# EAGLE design uSupply_upgrade (EAGLE 6.4)
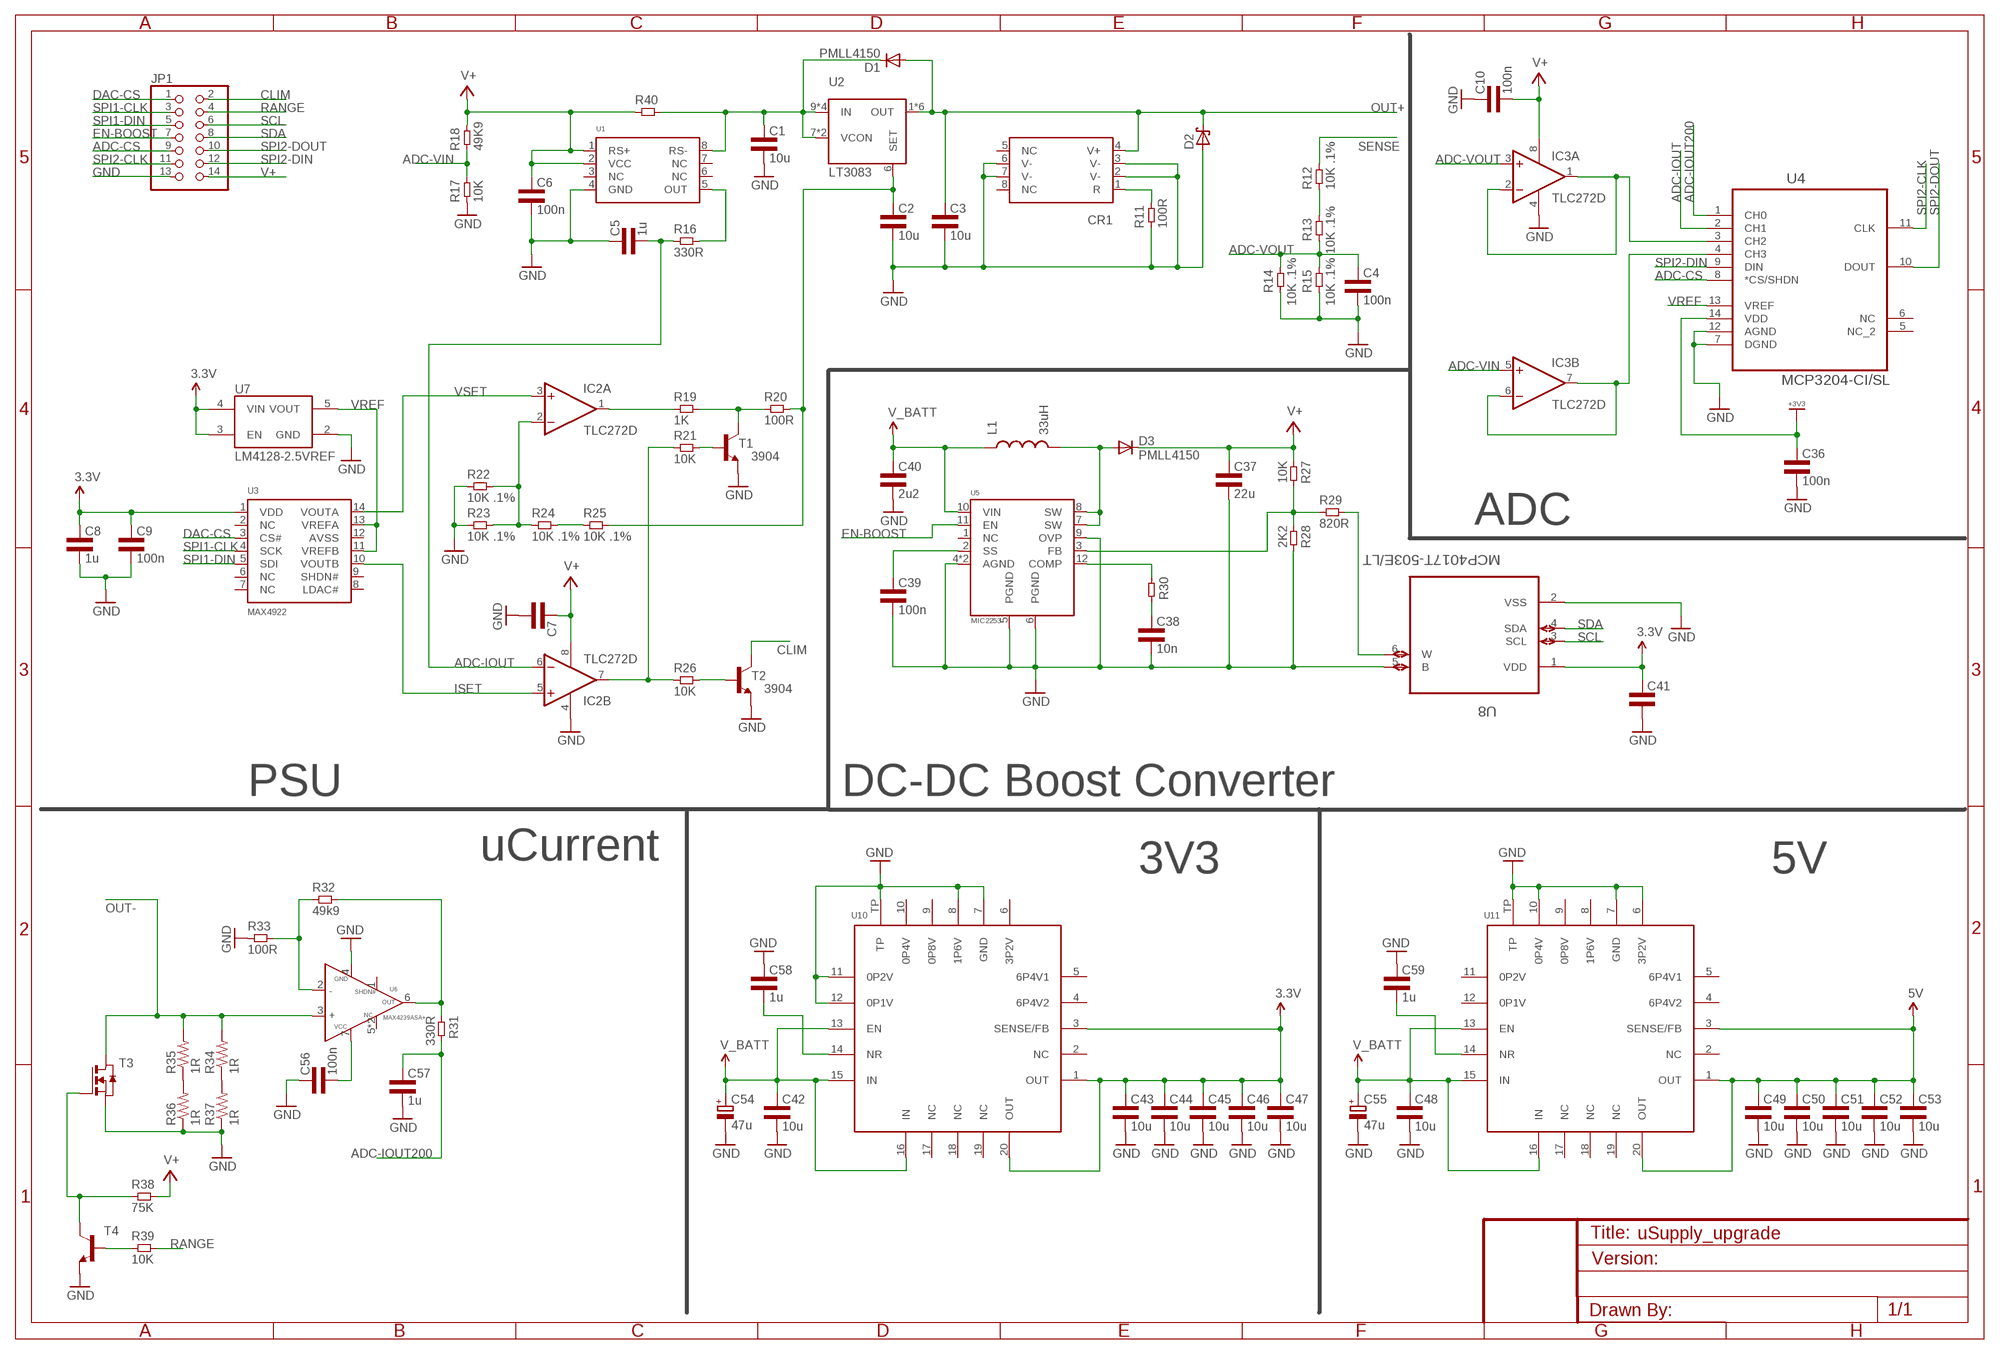
[diagram p0: schematic, sheet 1]

## Parts
C1  10u  CAP0805L3  [0805L3]
C2  10u  CAP0805L3  [0805L3]
C3  10u  CAP0805L3  [0805L3]
C4  100n  CAP0603L3  [0603L3]
C5  1u  CAP0603L3  [0603L3]
C6  100n  CAP0603L3  [0603L3]
C7  CAP0603L3  [0603L3]
C8  1u  CAP0603L3  [0603L3]
C9  100n  CAP0603L3  [0603L3]
C10  100n  CAP0603L3  [0603L3]
C36  100n  CAP0603L3  [0603L3]
C37  22u  CAP1206L3  [1206L3]
C38  10n  CAP0603L3  [0603L3]
C39  100n  CAP0603L3  [0603L3]
C40  2u2  CAP0603L3  [0603L3]
C41  CAP0603L3  [0603L3]
C42  10u  CAP0805L3  [0805L3]
C43  10u  CAP0805L3  [0805L3]
C44  10u  CAP0805L3  [0805L3]
C45  10u  CAP0805L3  [0805L3]
C46  10u  CAP0805L3  [0805L3]
C47  10u  CAP0805L3  [0805L3]
C48  10u  CAP0805L3  [0805L3]
C49  10u  CAP0805L3  [0805L3]
C50  10u  CAP0805L3  [0805L3]
C51  10u  CAP0805L3  [0805L3]
C52  10u  CAP0805L3  [0805L3]
C53  10u  CAP0805L3  [0805L3]
C54  47u  CPOL-EUCT7343  [CT7343]
C55  47u  CPOL-EUCT7343  [CT7343]
C56  100n  CAP0603L3  [0603L3]
C57  1u  CAP0603L3  [0603L3]
C58  1u  CAP0603L3  [0603L3]
C59  1u  CAP0603L3  [0603L3]
CR1  LM334  [R-PDSO-G8]
D1  PMLL4150  [SOD80C]
D2  SCHOTTKY-DIODESMD  [SMB]
D3  PMLL4150  [SOD80C]
IC2  TLC272D  [SO08]
IC3  TLC272D  [SO08]
JP1  PINHD-2X7  [2X07]
L1  33uH  INDUCTORBOURNS_SRN6045  [SRN6045]
R11  100R  RES0603L3  [0603L3]
R12  10K .1%  RES0603L3  [0603L3]
R13  10K .1%  RES0603L3  [0603L3]
R14  10K .1%  RES0603L3  [0603L3]
R15  10K .1%  RES0603L3  [0603L3]
R16  330R  RES0603L3  [0603L3]
R17  10K  RES0603L3  [0603L3]
R18  49K9  RES0603L3  [0603L3]
R19  1K  RES0603L3  [0603L3]
R20  100R  RES0603L3  [0603L3]
R21  10K  RES0603L3  [0603L3]
R22  10K .1%  RES0603L3  [0603L3]
R23  10K .1%  RES0603L3  [0603L3]
R24  10K .1%  RES0603L3  [0603L3]
R25  10K .1%  RES0603L3  [0603L3]
R26  10K  RES0603L3  [0603L3]
R27  10K  RES0603L3  [0603L3]
R28  2K2  RES0603L3  [0603L3]
R29  820R  RES0603L3  [0603L3]
R30  RES0603L3  [0603L3]
R31  330R  RES0603L3  [0603L3]
R32  49k9  RES0603L3  [0603L3]
R33  100R  RES0603L3  [0603L3]
R34  1R  R-US_R2512  [R2512]
R35  1R  R-US_R2512  [R2512]
R36  1R  R-US_R2512  [R2512]
R37  1R  R-US_R2512  [R2512]
R38  75K  RES0603L3  [0603L3]
R39  10K  RES0603L3  [0603L3]
R40  RES4527L3  [4527L3]
T1  3904  MMBT3904LT1-NPN-SOT23-BEC  [SOT23-BEC]
T2  3904  MMBT3904LT1-NPN-SOT23-BEC  [SOT23-BEC]
T3  NMOSSOT23  [SOT-23]
T4  MMBT3904LT1-NPN-SOT23-BEC  [SOT23-BEC]
U1  MAX4080  [UMAX]
U2  LT3083  [DFN4X4]
U3  MCP4922  [TSSOP-14]
U4  MCP3204-CI/SL  [SOIC127P600X175-14N]
U5  MIC2253  [MLF3X3]
U6  MAX4239  [SOIC-8]
U7  LM4128-2.5VREF  [SOT23-5]
U8  MCP4017T-503E/LT  [SOT65P210X110-6N]
U10  POWER-SUPPLY_POS_V1_TI_LDO_TPS7A4700  [POWER-SUPPLY_POS_V1_TI_LDO_VQFN-20]
U11  POWER-SUPPLY_POS_V1_TI_LDO_TPS7A4700  [POWER-SUPPLY_POS_V1_TI_LDO_VQFN-20]

## Nets
3.3V: C8.P$1 C9.P$1 C41.P$1 C43.1 C44.1 C45.1 C46.1 C47.1 U3.1(VDD) U7.3(EN) U7.4(VIN) U8.1(VDD) U10.1(OUT) U10.3(SENSE/FB) U10.20(OUT)
5V: C49.1 C50.1 C51.1 C52.1 C53.1 U11.1(OUT) U11.3(SENSE/FB) U11.20(OUT)
+3V3: C36.P$1 U4.14(VDD)
ADC-CS: JP1.9 U4.8(*CS/SHDN)
ADC-IOUT: C5.P$2 IC2.6(B:-IN) R16.P$1 U4.2(CH1)
ADC-IOUT200: C57.P$1 R31.P$2 U4.1(CH0)
ADC-VIN: IC3.5(B:+IN) R17.P$2 R18.P$1
ADC-VOUT: C4.P$1 IC3.3(A:+IN) R13.P$1 R14.P$2 R15.P$2
CLIM: JP1.2 T2.C
DAC-CS: JP1.1 U3.3(CS#)
EN-BOOST: JP1.7 U5.11(EN)
GND: C1.2 C2.2 C3.2 C4.P$2 C5.P$1 C6.P$2 C7.P$2 C8.P$2 C9.P$2 C10.P$1 C36.P$2 C37.2 C38.P$2 C39.P$2 C40.P$2 C41.P$2 C42.2 C43.2 C44.2 C45.2 C46.2 C47.2 C48.2 C49.2 C50.2 C51.2 C52.2 C53.2 C54.- C55.- C56.P$1 C57.P$2 C58.P$1 C59.P$1 CR1.2(V-) CR1.3(V-) CR1.6(V-) CR1.7(V-) D2.A IC2.4(P:V-) IC3.4(P:V-) JP1.13 R11.P$1 R14.P$1 R15.P$1 R17.P$1 R22.P$1 R23.P$1 R28.P$2 R33.P$1 R36.1 R37.1 T1.E T2.E T3.2(S) T4.E U1.4(GND) U4.7(DGND) U4.12(AGND) U5.4(AGND) U5.5(PGND) U5.6(PGND) U5.9(OVP) U5.TP(AGND) U6.4(GND) U7.2(GND) U8.2(VSS) U8.5(B) U10.7(GND) U10.8(1P6V) U10.11(0P2V) U10.12(0P1V) U10.TP U11.6(3P2V) U11.7(GND) U11.10(0P4V) U11.TP
I_R: CR1.1(R) R11.P$2
ISET: IC2.5(B:+IN) U3.10(VOUTB)
N$1: IC3.1(A:OUT) IC3.2(A:-IN) U4.3(CH2)
N$2: C56.P$2 U6.7(VCC)
N$3: D3.A L1.2 U5.7(SW) U5.8(SW)
N$4: C59.P$2 U11.14(NR)
N$5: R16.P$2 U1.5(OUT)
N$6: C58.P$2 U10.14(NR)
N$7: R31.P$1 R32.P$2 U6.6(OUT)
N$8: IC3.6(B:-IN) IC3.7(B:OUT) U4.4(CH3)
N$9: R29.P$2 U8.6(W)
N$10: R12.P$1 R13.P$2
N$11: R27.P$2 R28.P$1 R29.P$1 U5.3(FB)
N$12: R30.P$1 U5.12(COMP)
N$13: C38.P$1 R30.P$2
N$14: IC2.1(A:OUT) R19.P$1
N$15: R19.P$2 R20.P$1 T1.C
N$16: R21.P$2 T1.B
N$17: IC2.2(A:-IN) R22.P$2 R23.P$2 R24.P$1
N$18: R24.P$2 R25.P$1
N$20: R32.P$1 R33.P$2 U6.2(-)
N$22: C39.P$1 U5.2(SS)
N$23: IC2.7(B:OUT) R21.P$1 R26.P$1
N$24: R26.P$2 T2.B
N$27: R34.1 R37.2
N$28: R35.1 R36.2
N$31: R38.P$1 T3.3(G) T4.C
N$32: R39.P$1 T4.B
OUT+: C3.1 CR1.4(V+) D1.A D2.C U2.1(OUT) U2.2(OUT) U2.3(OUT) U2.4(OUT) U2.5(OUT) U2.TP(OUT)
OUT-: R34.2 R35.2 T3.1(D) U6.3(+)
RANGE: JP1.4 R39.P$2
SCL: JP1.6 U8.3(SCL)
SDA: JP1.8 U8.4(SDA)
SENSE: R12.P$2
SET: C2.1 R20.P$2 R25.P$2 U2.6(SET)
SPI1-CLK: JP1.3 U3.4(SCK)
SPI1-DIN: JP1.5 U3.5(SDI)
SPI2-CLK: JP1.11 U4.11(CLK)
SPI2-DIN: JP1.12 U4.9(DIN)
SPI2-DOUT: JP1.10 U4.10(DOUT)
V+: C6.P$1 C7.P$1 C10.P$2 C37.1 D3.C IC2.8(P:V+) IC3.8(P:V+) JP1.14 R18.P$2 R27.P$1 R38.P$2 R40.1 U1.1(RS+) U1.2(VCC)
V+_REG: C1.1 D1.C R40.2 U1.8(RS-) U2.7(VCON) U2.8(VCON) U2.9(IN) U2.10(IN) U2.11(IN) U2.12(IN)
V_BATT: C40.P$1 C42.1 C48.1 C54.+ C55.+ L1.1 U5.10(VIN) U10.13(EN) U10.15(IN) U10.16(IN) U11.13(EN) U11.15(IN) U11.16(IN)
VREF: U3.11(VREFB) U3.13(VREFA) U4.13(VREF) U7.5(VOUT)
VSET: IC2.3(A:+IN) U3.14(VOUTA)
Unconnected: CR1.5(NC) CR1.8(NC) U1.3(NC) U1.6(NC) U1.7(NC) U3.2(NC) U3.6(NC) U3.7(NC) U3.8(LDAC#) U3.9(SHDN#) U3.12(AVSS) U4.5(NC_2) U4.6(NC) U5.1(NC) U6.1(SHDN#) U6.5(NC) U6.8(NC) U10.2(NC) U10.4(6P4V2) U10.5(6P4V1) U10.6(3P2V) U10.9(0P8V) U10.10(0P4V) U10.17(NC) U10.18(NC) U10.19(NC) U11.2(NC) U11.4(6P4V2) U11.5(6P4V1) U11.8(1P6V) U11.9(0P8V) U11.11(0P2V) U11.12(0P1V) U11.17(NC) U11.18(NC) U11.19(NC)

## Notes on the sheet
- ADC
- PSU | DC-DC Boost Converter
- uCurrent | 3V3 | 5V

## Library data of the parts
C1-C10 C36-C53 C56-C59 = common:CAP
C54 C55 = rcl:CPOL-EU: POLARIZED CAPACITOR, European symbol
CR1 = common:LM334
D1 D3 = diode:PMLL4150: DIODE high speed
D2 = diode:SCHOTTKY-DIODE: Schottky Diode
IC2 IC3 = linear:TLC272: OP AMP
JP1 = pinhead:PINHD-2X7: PIN HEADER
L1 = SparkFun-Passives:INDUCTOR: Inductors Basic Inductor/Choke - 0603 and 1206. Footprints are not proven and vary greatly between part numbers. SRN6045- 33uH, 20% 1.4A; PROD_ID: NDUC-11627
R11-R33 R38-R40 = common:RES
R34-R37 = rcl:R-US_: RESISTOR, American symbol
T1 T2 T4 = transistor:*-NPN-: NPN Transistror BF959 corrected 2008.03.06
T3 = zetex:NMOSSOT23: MOS FET; OC_FARNELL: unknown; OC_NEWARK: unknown
U1 = common:MAX4080: High-side current-sense amplifier. 4.5V to 76V.
U2 = common:LT3083
U3 = common:MCP4922
U4 = Microchip_By_element14_Batch_1:MCP3204-CI/SL: IC ADC 12BIT 2.7V 4CH SPI; MPN: MCP3204-CI/SL; OC_FARNELL: 1196795; OC_NEWARK: 26M1276; PACKAGE: 14 - SOIC; SUPPLIER: Microchip
U5 = common:MIC2253: Boost Regulator
U6 = common:MAX4239: The MAX4238/MAX4239 are low-noise, low-drift, ultrahigh precision amplifiers that offer near-zero DC offset and drift through the use of patented autocorrelating zeroing techniques. This method constantly measures and compensates the input offset, eliminating drift over time and temperature and the effect of 1/f noise. Both devices feature rail-to-rail outputs, operate from a single 2.7V to 5.5V supply, and consume only 600µA. An activelow shutdown mode decreases supply current to 0.1µA.
U7 = SparkFun-PowerIC:LM4128-2.5VREF: .1% accurate low-current voltage reference
U8 = Microchip_By_element14_Batch_1:MCP4017T-503E/LT: Digital POT; MPN: MCP4017T-503E/LT; OC_FARNELL: 1825017; OC_NEWARK: 08R1800; PACKAGE: SOT-6; SUPPLIER: Microchip
U10 U11 = my_dac_amp:POWER-SUPPLY_POS_V1_TI_LDO_TPS7A4700

## Board
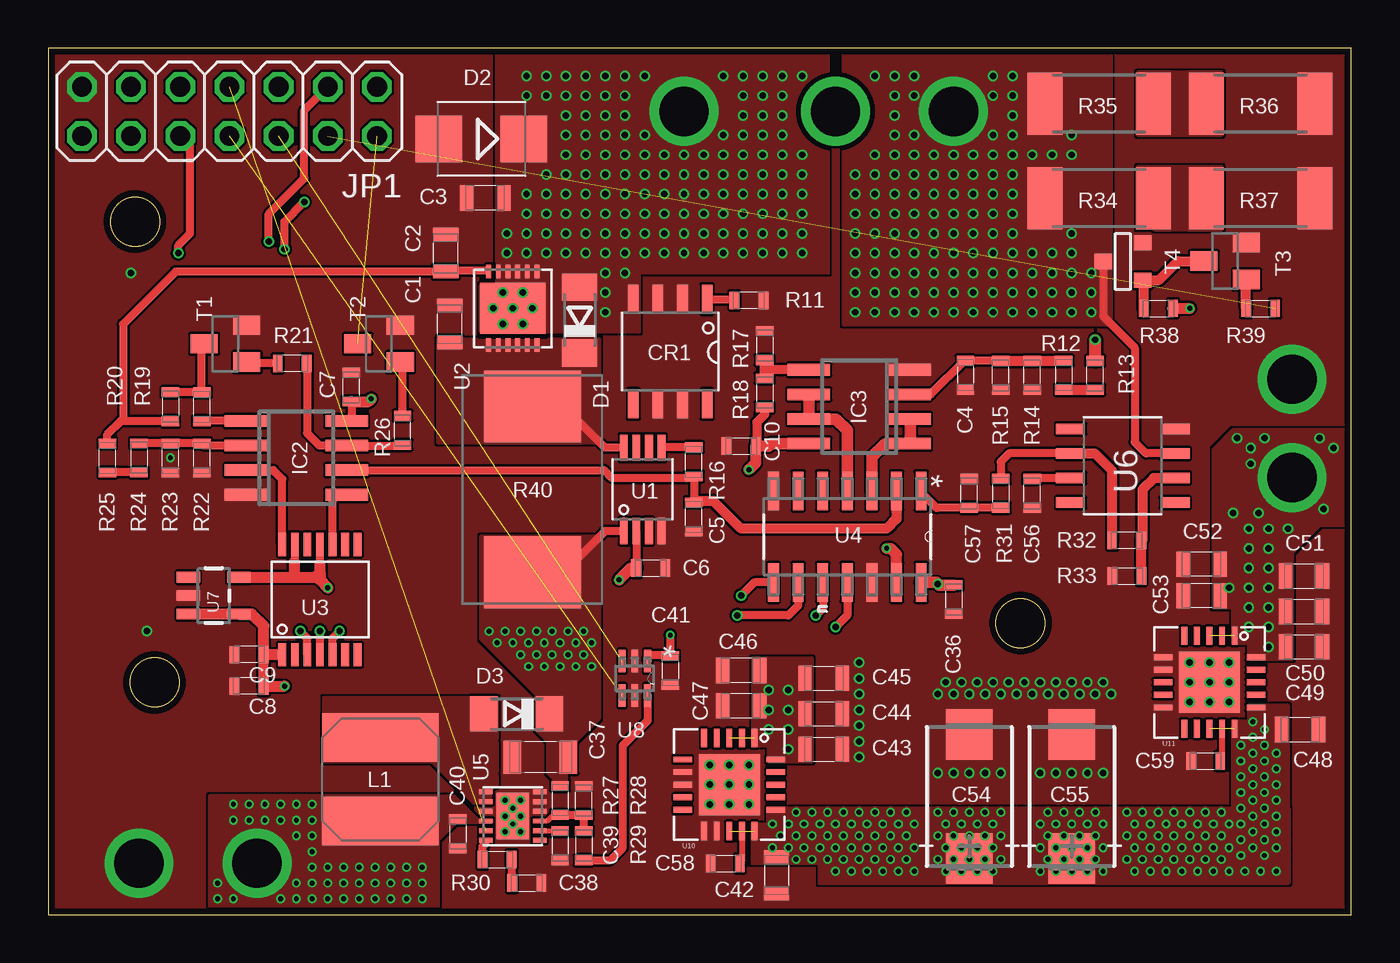
[diagram p1: board, top side]
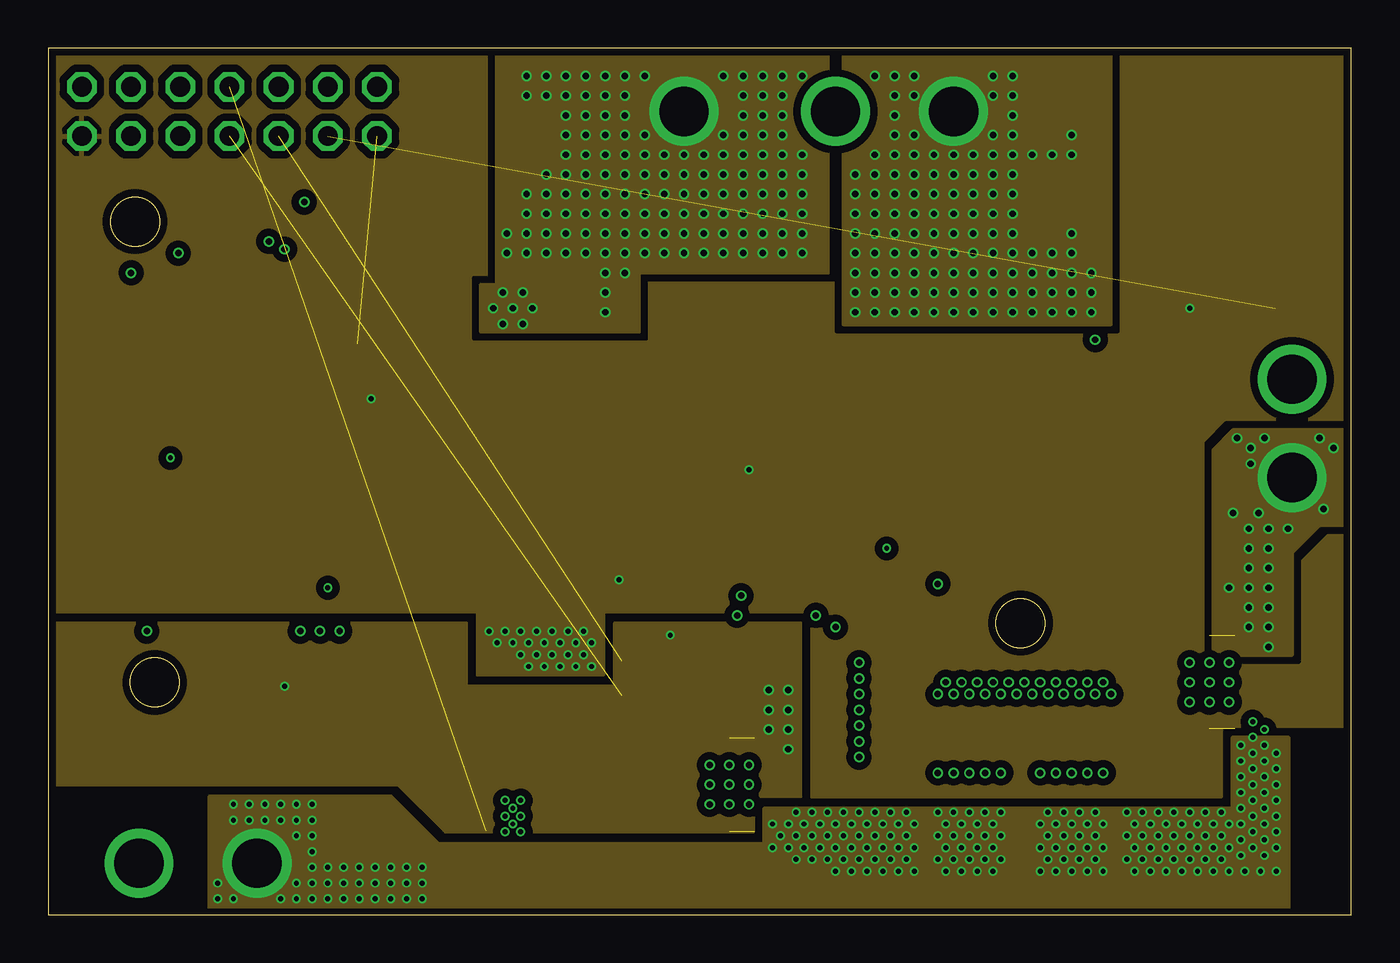
[diagram p2: board, inner layer Route2]
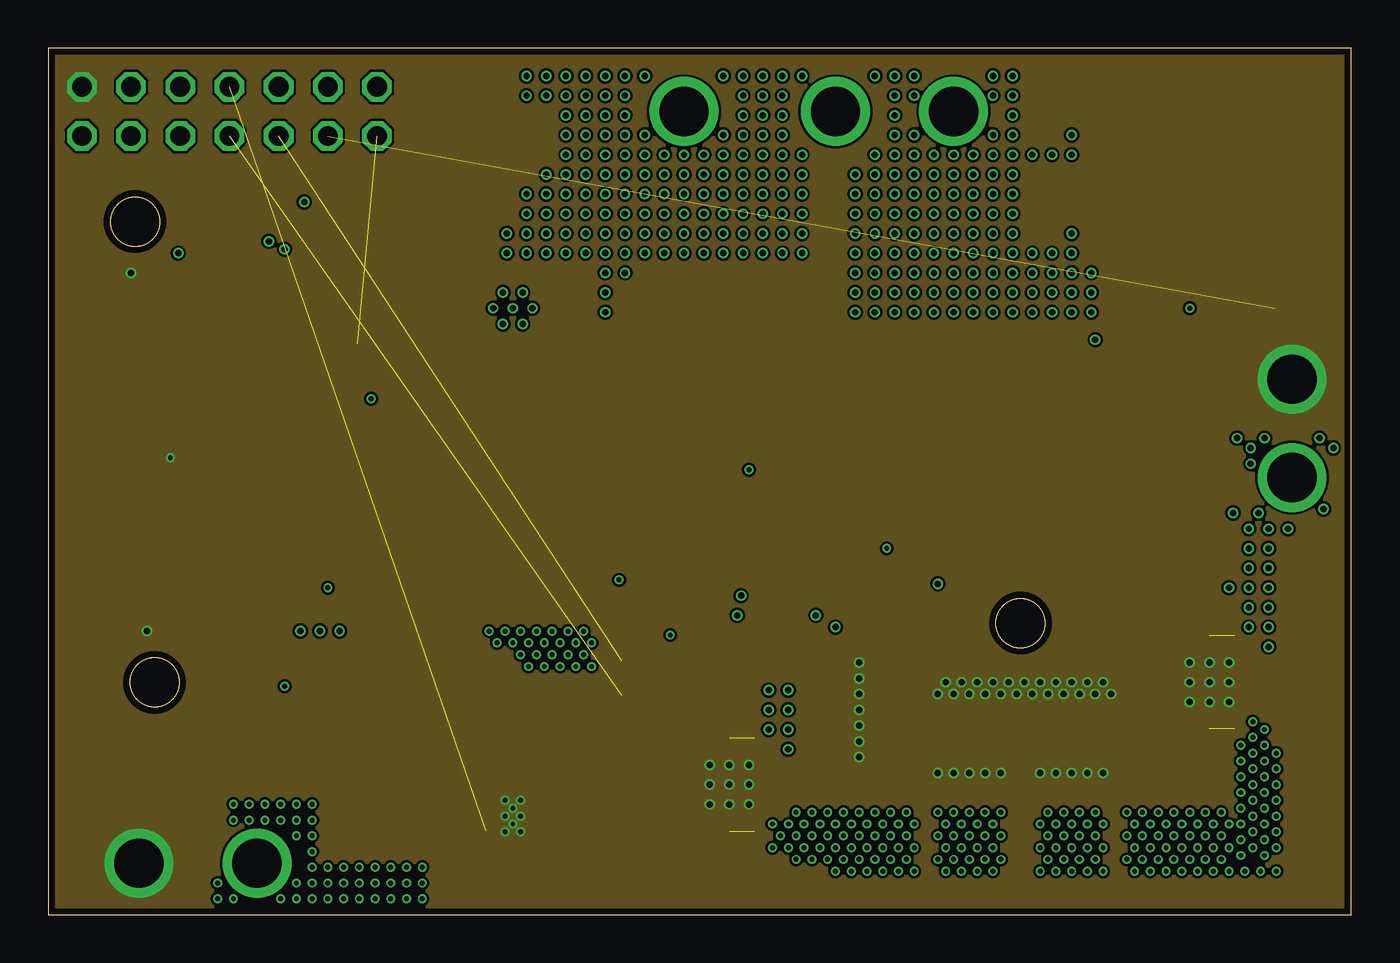
[diagram p3: board, inner layer Route3]
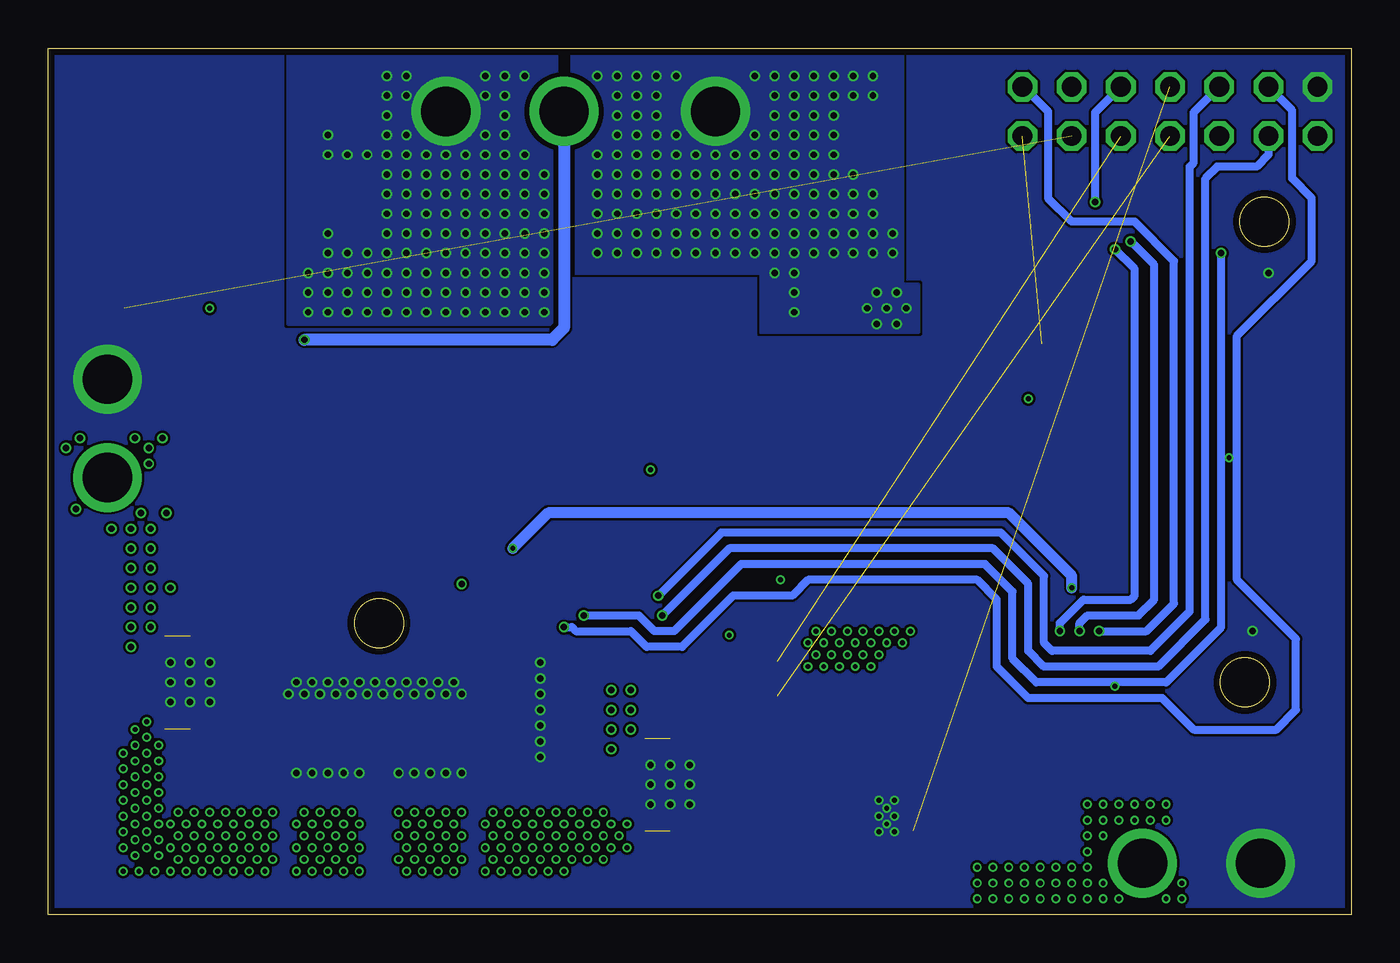
[diagram p4: board, bottom side, seen from below]

Size 67.26 x 44.7 mm. Coordinates in mm from the lower left corner, seen from the top.
Outline: 67.26,0 67.26,44.7 0,44.7 0,0 67.26,0
Outline: circle at 5.49,11.99 radius 1.27
Outline: circle at 50.19,15.04 radius 1.27
Outline: circle at 4.47,35.76 radius 1.27
Copper layers (1*2*3*16): Top 0.035mm / dielectric 1.5mm / Route2 0.035mm / dielectric 0.15mm / Route3 0.035mm / dielectric 0.2mm / Bottom 0.035mm
Design rules "default *": minimum track width 5mil, minimum drill 10mil, track to track 5mil, track to pad 5mil, pad to pad 5mil, via to via 5mil, smd to smd 5mil, copper to edge 13mil, drill to drill 8mil, minimum pad ring 4mil, minimum via ring 4mil, stop-mask expansion 4mil, vias tented up to drill 0mil, thermal gap 10mil

### Footprints (pad centres in the part's own frame; a part is rotated, then mirrored left to right if it is on the bottom)
0805L3 = smd 0.7 x 1.3: 1 -0.95,0; 2 0.95,0
0603L3 = smd 0.5 x 0.9: P$1 -0.75,0; P$2 0.75,0
1206L3 = smd 0.9 x 1.7: 1 -1.45,0; 2 1.45,0
CT7343 = smd 2.6 x 2.4: + -3.2,0; - 3.2,0
R-PDSO-G8 = smd 0.55 x 1.5: 1 -1.905,-2.7; 2 -0.635,-2.7; 3 0.635,-2.7; 4 1.905,-2.7; 5 1.905,2.7; 6 0.635,2.7; 7 -0.635,2.7; 8 -1.905,2.7
SOD80C = smd 1.4 x 1.8: A 1.7,0; C -1.7,0
SMB = smd 2.4 x 2.4: A 2.2,0; C -2.2,0
SO08 = smd 0.6 x 2.2: 1 -1.905,-2.6; 2 -0.635,-2.6; 3 0.635,-2.6; 4 1.905,-2.6; 5 1.905,2.6; 6 0.635,2.6; 7 -0.635,2.6; 8 -1.905,2.6
2X07 = drill 1.016 octagon: 1 -7.62,-1.27; 2 -7.62,1.27; 3 -5.08,-1.27; 4 -5.08,1.27; 5 -2.54,-1.27; 6 -2.54,1.27; 7 0,-1.27; 8 0,1.27; 9 2.54,-1.27; 10 2.54,1.27; 11 5.08,-1.27; 12 5.08,1.27; 13 7.62,-1.27; 14 7.62,1.27
SRN6045 = smd 2.5 x 6: 1 -2.175,-0.175; 2 2.125,-0.175
R2512 = smd 1.8 x 3.2: 1 -2.8,0; 2 2.8,0
4527L3 = smd 3.7 x 5: 1 -4.275,0; 2 4.275,0
SOT23-BEC = smd 1 x 1.4: B -0.95,-1.1; C 0,1.1; E 0.95,-1.1
SOT-23 = smd 0.787 x 0.889: 1 0.025,-1.016; 2 -0.94,1.016; 3 0.991,1.016
UMAX = smd 0.4 x 1.35: 1 -0.975,-2.15; 2 -0.325,-2.15; 3 0.325,-2.15; 4 0.975,-2.15; 5 0.975,2.15; 6 0.325,2.15; 7 -0.325,2.15; 8 -0.975,2.15
DFN4X4 = smd 0.25 x 0.7: 1 -1.25,-1.9; 2 -0.75,-1.9; 3 -0.25,-1.9; 4 0.25,-1.9; 5 0.75,-1.9; 6 1.25,-1.9; 7 1.25,1.9; 8 0.75,1.9; 9 0.25,1.9; 10 -0.25,1.9; 11 -0.75,1.9; 12 -1.25,1.9 | smd 3.38 x 2.65: TP 0,0
TSSOP-14 = smd 1.2 x 0.4: 1 -2.85,1.95; 2 -2.85,1.3; 3 -2.85,0.65; 4 -2.85,0; 5 -2.85,-0.65; 6 -2.85,-1.3; 7 -2.85,-1.95; 8 2.85,-1.95; 9 2.85,-1.3; 10 2.85,-0.65; 11 2.85,0; 12 2.85,0.65; 13 2.85,1.3; 14 2.85,1.95
SOIC127P600X175-14N = smd 1.981 x 0.559: 1 -2.362,3.81; 2 -2.362,2.54; 3 -2.362,1.27; 4 -2.362,0; 5 -2.362,-1.27; 6 -2.362,-2.54; 7 -2.362,-3.81; 8 2.362,-3.81; 9 2.362,-2.54; 10 2.362,-1.27; 11 2.362,0; 12 2.362,1.27; 13 2.362,2.54; 14 2.362,3.81
MLF3X3 = smd 0.25 x 0.7: 1 -1.25,-1.39; 2 -0.75,-1.39; 3 -0.25,-1.39; 4 0.25,-1.39; 5 0.75,-1.39; 6 1.25,-1.39; 7 1.25,1.39; 8 0.75,1.39; 9 0.25,1.39; 10 -0.25,1.39; 11 -0.75,1.39; 12 -1.25,1.39 | smd 2.4 x 1.68: TP 0,0
SOIC-8 = smd 0.55 x 1.5: 1 -1.905,-2.7; 2 -0.635,-2.7; 3 0.635,-2.7; 4 1.905,-2.7; 5 1.905,2.7; 6 0.635,2.7; 7 -0.635,2.7; 8 -1.905,2.7
SOT23-5 = smd 0.55 x 1.2: 1 -0.95,-1.3; 2 0,-1.3; 3 0.95,-1.3; 4 0.95,1.3; 5 -0.95,1.3
SOT65P210X110-6N = smd 1.168 x 0.356: 1 -0.889,0.66; 2 -0.889,0; 3 -0.889,-0.66; 4 0.889,-0.66; 5 0.889,0; 6 0.889,0.66
POWER-SUPPLY_POS_V1_TI_LDO_VQFN-20 = smd 0.3 x 0.95: 1 -1.3,-2.4; 2 -0.65,-2.4; 3 0,-2.4; 4 0.65,-2.4; 5 1.3,-2.4; 11 1.3,2.4; 12 0.65,2.4; 13 0,2.4; 14 -0.65,2.4; 15 -1.3,2.4 | smd 0.95 x 0.3: 6 2.4,-1.3; 7 2.4,-0.65; 8 2.4,0; 9 2.4,0.65; 10 2.4,1.3; 16 -2.4,1.3; 17 -2.4,0.65; 18 -2.4,0; 19 -2.4,-0.65; 20 -2.4,-1.3 | smd 3.15 x 3.15: TP 0,0

### Placement (x,y rotation side)
C1  20.73,30.48 90 top
C2  20.52,34.14 90 top
C3  22.56,36.98 180 top
C4  47.35,27.84 270 top
C5  33.32,20.52 90 top
C6  31.09,17.88 0 top
C7  15.65,27.23 90 top
C8  10.36,11.79 180 top
C9  10.36,13.41 180 top
C10  35.76,24.18 0 top
C36  46.74,16.26 270 top
C37  25.4,8.13 180 top
C38  24.69,1.63 0 top
C39  26.42,3.56 270 top
C40  21.13,4.17 270 top
C41  32.11,12.6 270 top
C42  37.59,2.03 270 top
C43  40.03,8.53 0 top
C44  40.03,10.36 0 top
C45  40.03,12.19 0 top
C46  35.76,12.6 180 top
C47  35.76,10.77 180 top
C48  64.62,9.55 0 top
C49  64.82,13.82 0 top
C50  64.82,15.65 0 top
C51  64.82,17.48 0 top
C52  59.54,18.08 180 top
C53  59.54,16.46 180 top
C54  47.55,6.1 90 top
C55  52.83,6.1 90 top
C56  50.8,21.74 90 top
C57  47.55,21.74 90 top
C58  34.95,2.64 0 top
C59  59.74,7.92 0 top
CR1  32.11,29.06 180 top
D1  27.43,30.68 90 top
D2  22.35,40.03 180 top
D3  24.18,10.36 180 top
IC2  12.8,23.57 270 top
IC3  41.86,26.21 90 top
JP1  9.35,41.45 180 top
L1  16.97,7.01 90 top
R11  36.17,31.7 180 top
R12  54.05,27.84 90 top
R13  52.43,27.84 270 top
R14  50.8,27.84 90 top
R15  49.17,27.84 90 top
R16  33.32,23.37 90 top
R17  36.98,29.36 270 top
R18  36.98,26.92 270 top
R19  7.92,26.21 90 top
R20  6.3,26.21 270 top
R21  12.6,28.45 180 top
R22  7.92,23.57 90 top
R23  6.3,23.57 90 top
R24  4.67,23.57 270 top
R25  3.05,23.57 90 top
R26  18.29,24.99 90 top
R27  26.42,5.89 270 top
R28  27.64,5.89 90 top
R29  27.64,3.56 270 top
R30  23.16,2.84 0 top
R31  49.17,21.74 270 top
R32  55.68,19.3 180 top
R33  55.68,17.48 0 top
R34  54.25,36.98 180 top
R35  54.25,41.86 180 top
R36  62.59,41.86 180 top
R37  62.59,36.98 180 top
R38  57.3,31.29 0 top
R39  62.59,31.29 0 top
R40  24.99,21.95 90 top
T1  9.14,29.46 90 top
T2  17.07,29.46 90 top
T3  55.47,33.73 270 top
T4  60.76,33.73 90 top
U1  30.68,21.95 0 top
U2  23.98,31.29 180 top
U3  14.02,16.26 90 top
U4  41.25,19.51 270 top
U5  23.98,5.08 90 top
U6  55.47,23.16 90 top
U7  8.53,16.46 270 top
U8  30.28,12.19 270 top
U10  35.15,6.71 180 top
U11  59.94,11.99 180 top

### Tracks (layer width: path | path; a pad name or v marks a point on that pad's centre or on a via)
3.3V  (via drill 0.25, 0.33)  (1 unrouted)
  Top 0.406: U3.1 11.99,13.41 | U8.1 30.94,13.26 31.09,13.41 32.04,13.41 C41.P$1 v32.11,14.43
  Top 0.508: C8.P$1 C9.P$1
  Top 0.559: 11.99,13.41 C9.P$1 11.11,14.9 10.5,15.51 U7.4 U7.3 | C8.P$1 v12.19,11.79
  other vias: 38.2,8.53 38.2,9.55 38.2,10.57 38.2,11.58 37.19,9.55 37.19,10.57 37.19,11.58
  pour Top (isolate 0.254, no thermals): 36.37,13.21 36.37,8.74 37.19,8.74 37.19,7.92 39.42,7.92 39.42,13.21
  pour Route2 (isolate 0.381): 38.81,15.04 38.81,6.1 36.37,6.1 36.37,4.27 20.52,4.27 18.08,6.71 0.2,6.71 0.2,15.04 21.54,15.04 21.54,11.79 29.26,11.79 29.26,15.04
5V  (via drill 0.33, 2.54)  (1 unrouted)
  other vias: 62.99,13.82 62.99,14.83 62.99,15.85 62.99,16.87 61.98,16.87 61.98,15.85 61.98,14.83 60.96,16.87 64.21,22.56 61.98,17.88 61.98,18.9 61.98,19.91 62.48,20.73 62.99,17.88 62.99,18.9 62.99,19.91 64.01,19.91 62.08,23.27 62.08,24.08 61.37,24.59 66.34,24.08 65.84,20.93 61.16,20.73 62.79,24.59 65.63,24.59
  pour Top (no thermals): 61.98,13.21 64.21,13.21 64.21,18.69 60.15,18.69 60.15,15.85 61.16,15.85 61.16,14.02 61.98,14.02
  pour Top (isolate 0.254, no thermals): 67.06,24.99 61.16,24.99 60.15,23.98 60.15,15.85 64.21,15.85 64.21,18.69 65.63,20.12 67.06,20.12
  pour Route2 (isolate 0.381, no thermals): 67.06,24.99 61.16,24.99 60.15,23.98 60.15,13.41 64.21,13.41 64.21,18.69 65.63,20.12 67.06,20.12
+3V3  (via drill 0.33)
  Top 0.584: U4.14 45.85,17.15 v45.92,17.07 45.99,17.01 C36.P$1
ADC-CS  (via drill 0.33)
  Top 0.406: U4.8 36.45,17.15 v35.76,16.46
  Bottom 0.406: JP1.9 8.13,41.4 8.13,38.81 8.33,38.61 8.33,15.65 10.36,13.61 15.44,13.61 15.85,14.02 15.85,17.48 18.09,19.71 32.51,19.71 v35.76,16.46
ADC-IOUT
  Top 0.406: C5.P$2 R16.P$1 33.26,22.56 29.06,22.56 28.68,22.94 IC2.6
  Top 0.508: U4.2 43.79,20.42 43.28,19.91 35.76,19.91 34.34,21.34 33.39,21.34 C5.P$2
ADC-IOUT200
  Top 0.406: U4.1 45.06,21.79 45.86,20.99 C57.P$1 R31.P$2
ADC-VIN
  Top 0.457: R18.P$1 36.98,28.25 | 36.98,28.25 R17.P$2 | IC3.5 37.11,28.12 36.98,28.25
ADC-VOUT
  Top 0.406: R15.P$2 C4.P$1 47.28,28.59 45.54,26.85 IC3.3
  Top 0.508: R15.P$2 R14.P$2 R13.P$1
CLIM  (1 unrouted)
DAC-CS  (via drill 0.33)
  Top 0.406: U3.3 13.37,14.26 v13,14.63
  Bottom 0.406: v13,14.63 10.57,14.63 9.14,16.05 9.14,33.73 11.18,35.76 14.43,35.76 15.65,36.98 15.65,41.45 16.92,42.72 JP1.1
EN-BOOST  (1 unrouted)
GND  (via drill 0.25, 0.33, 2.54)
  other vias: 35.15,6.71 59.94,11.99 34.14,6.71 36.17,6.71 36.17,5.69 36.17,7.72 35.15,5.69 34.14,5.69 34.14,7.72 35.15,7.72 60.96,11.99 58.93,11.99 58.93,10.97 58.93,13 60.96,10.97 60.96,13 59.94,13 59.94,10.97 4.67,2.64 23.57,5.89 24.38,5.89 23.57,5.08 24.38,5.08 23.98,4.67 23.57,4.27 24.38,4.27 23.98,5.49 64.21,27.64 6.3,23.57 41.86,13 41.86,12.19 41.86,11.38 41.86,10.57 41.86,9.75 41.86,8.94 41.86,8.13 45.92,11.38 46.74,11.38 47.55,11.38 48.36,11.38 49.17,11.38 49.99,11.38 50.8,11.38 51.61,11.38 52.43,11.38 53.24,11.38 54.05,11.38 54.86,11.38 54.46,11.99 53.64,11.99 52.83,11.99 52.02,11.99 51.21,11.99 50.39,11.99 49.58,11.99 48.77,11.99 47.96,11.99 47.14,11.99 46.33,11.99 45.92,7.32 46.74,7.32 47.55,7.32 48.36,7.32 49.17,7.32 51.21,7.32 52.02,7.32 52.83,7.32 53.64,7.32 54.46,7.32 4.27,33.12 5.08,14.63
  pour Top (rank 6, no thermals): 0.2,44.5 67.06,44.5 67.06,0.2 0.2,0.2
  pour Bottom (rank 6, no thermals): 0.2,44.5 67.06,44.5 67.06,0.2 0.2,0.2
  pour Route3 (rank 6, no thermals): 0.2,44.5 67.06,44.5 67.06,0.2 0.2,0.2
I_R
  Top 0.406: CR1.1 35.36,31.76 R11.P$2
ISET
  Top 0.406: U3.10 14.67,21.38 14.96,21.67 IC2.5
N$1
  Top 0.584: IC3.2 44.5,25.54 44.5,24.38 44.46,24.34 IC3.1 43.2,24.31 42.52,23.62 U4.3
N$2
  Top 0.406: U6.7 50.84,22.53 C56.P$2
N$3
  pour Top (isolate 0.254, no thermals): 22.86,5.79 22.86,6.4 23.16,6.71 23.16,11.18 14.22,11.18 14.22,7.92 19.81,7.92 21.95,5.79
N$4
  Top 0.305: U11.14 60.59,8.03 C59.P$2
N$5
  Top 0.406: R16.P$2 31.68,24.12 U1.5
N$6
  Top 0.305: U10.14 35.8,2.75 C58.P$2
N$7
  Top 0.406: U6.6 49.61,23.8 49.17,23.37 R31.P$1
  Top 0.508: U6.6 54.03,23.8 54.93,22.9 R32.P$2
N$8
  Top 0.584: IC3.6 IC3.7 40.66,25.58 41.25,24.99 U4.4
N$9
  Top 0.406: R29.P$2 29.02,2.81 29.67,3.45 29.67,8.74 30.94,10.01 U8.6
N$10
  Top 0.508: R13.P$2 R12.P$1
N$11
  Top 0.254: U5.3 25.76,4.83 26.01,5.08 26.35,5.08 R27.P$2
  Top 0.406: R27.P$2 R28.P$1 R29.P$1
N$12
  Top 0.203: 22.55,3.66 22.55,3.8 U5.12
  Top 0.406: R30.P$1 22.41,3.52 22.55,3.66
N$13
  Top 0.406: C38.P$1 23.94,2.82 R30.P$2
N$14
  Top 0.406: IC2.1 7.94,25.48 R19.P$1
N$15
  Top 0.406: R20.P$1 R19.P$2 7.92,29.35 T1.C
N$16
  Top 0.406: R21.P$2 10.31,28.45 T1.B
N$17
  Top 0.406: IC2.2 8.04,24.21 R22.P$2 R23.P$2 R24.P$1
N$18
  Top 0.406: R24.P$2 R25.P$1
N$20
  Top 0.508: U6.2 57.07,22.53 56.49,21.95 56.49,19.37 R32.P$1 R33.P$2
N$22
  Top 0.254: U5.2 26.39,4.33 C39.P$1
N$23
  Top 0.406: R26.P$1 18.25,24.21 IC2.7 13.99,24.21 13.35,24.85 R21.P$1
N$24
  Top 0.406: R26.P$2 18.29,28.4 T2.B
N$27
  pour Top (isolate 0.254, no thermals): 56.29,38.61 60.55,38.61 60.55,35.36 56.29,35.36
N$28
  pour Top (isolate 0.254, no thermals): 56.29,43.48 60.55,43.48 60.55,40.23 56.29,40.23
N$31
  Top 0.508: R38.P$1 56.55,32.68 T3.3 57.33,32.74 58.32,33.73 T4.C
N$32
  Top 0.508: R39.P$1 61.84,32.76 T4.B
OUT+  (via drill 0.33, 2.54)
  other vias: 23.98,31.29 22.96,31.29 24.99,31.29 24.49,32.11 23.47,32.11 23.47,30.48 24.49,30.48 32.82,41.45 23.67,34.14 24.69,34.14 25.7,34.14 26.72,34.14 27.74,34.14 28.75,34.14 29.77,34.14 30.78,34.14 31.8,34.14 32.82,34.14 33.83,34.14 34.85,34.14 35.86,34.14 36.88,34.14 37.9,34.14 38.91,34.14 23.67,35.15 24.69,35.15 25.7,35.15 26.72,35.15 27.74,35.15 28.75,35.15 29.77,35.15 30.78,35.15 31.8,35.15 32.82,35.15 33.83,35.15 34.85,35.15 35.86,35.15 36.88,35.15 37.9,35.15 38.91,35.15 24.69,36.17 25.7,36.17 26.72,36.17 27.74,36.17 28.75,36.17 29.77,36.17 30.78,36.17 31.8,36.17 32.82,36.17 33.83,36.17 34.85,36.17 35.86,36.17 36.88,36.17 37.9,36.17 38.91,36.17 28.75,33.12 29.77,33.12 28.75,32.11 28.75,31.09 24.69,37.19 25.7,37.19 26.72,37.19 27.74,37.19 28.75,37.19 29.77,37.19 30.78,37.19 31.8,37.19 32.82,37.19 33.83,37.19 34.85,37.19 35.86,37.19 36.88,37.19 37.9,37.19 38.91,37.19 26.72,38.2 25.7,38.2 27.74,38.2 28.75,38.2 29.77,38.2 30.78,38.2 31.8,38.2 32.82,38.2 33.83,38.2 34.85,38.2 35.86,38.2 36.88,38.2 37.9,38.2 38.91,38.2 26.72,39.22 26.72,40.23 26.72,41.25 26.72,42.27 25.7,42.27 24.69,42.27 27.74,39.22 28.75,39.22 29.77,39.22 30.78,39.22 31.8,39.22 32.82,39.22 33.83,39.22 34.85,39.22 35.86,39.22 36.88,39.22 37.9,39.22 38.91,39.22 27.74,40.23 28.75,40.23 29.77,40.23 30.78,40.23 34.85,40.23 35.86,40.23 36.88,40.23 37.9,40.23 35.86,41.25 27.74,41.25 28.75,41.25 29.77,41.25 29.77,42.27 27.74,42.27 28.75,42.27 36.88,41.25 37.9,41.25 35.86,42.27 36.88,42.27 37.9,42.27 24.69,43.28 25.7,43.28 26.72,43.28 27.74,43.28 28.75,43.28 29.77,43.28 30.78,43.28 35.86,43.28 34.85,43.28 36.88,43.28 37.9,43.28 38.91,43.28
  pour Top (isolate 0.254, no thermals): 22.35,30.07 22.35,32.51 23.16,32.51 23.16,44.5 40.23,44.5 40.23,33.12 30.48,33.12 30.48,30.07
  pour Bottom (isolate 0.254, no thermals): 22.35,30.07 22.35,32.51 23.16,32.51 23.16,44.5 40.23,44.5 40.23,33.12 30.48,33.12 30.48,30.07
  pour Route2 (isolate 0.381, no thermals): 22.35,30.07 22.35,32.51 23.16,32.51 23.16,44.5 40.23,44.5 40.23,33.12 30.48,33.12 30.48,30.07
OUT-  (via drill 0.33, 2.54)
  Top 0.406: U6.3 56.67,23.8 56.08,24.38 56.08,29.26 54.46,30.89 T3.1
  other vias: 41.66,31.09 46.74,41.45 42.67,31.09 43.69,31.09 44.7,31.09 45.72,31.09 46.74,31.09 47.75,31.09 48.77,31.09 49.78,31.09 50.8,31.09 51.82,31.09 52.83,31.09 53.85,31.09 41.66,32.11 42.67,32.11 43.69,32.11 44.7,32.11 45.72,32.11 46.74,32.11 47.75,32.11 48.77,32.11 49.78,32.11 50.8,32.11 51.82,32.11 52.83,32.11 53.85,32.11 41.66,33.12 42.67,33.12 43.69,33.12 44.7,33.12 45.72,33.12 46.74,33.12 47.75,33.12 48.77,33.12 49.78,33.12 50.8,33.12 51.82,33.12 52.83,33.12 53.85,33.12 41.66,34.14 42.67,34.14 43.69,34.14 44.7,34.14 45.72,34.14 46.74,34.14 47.75,34.14 48.77,34.14 49.78,34.14 50.8,34.14 51.82,34.14 52.83,34.14 41.66,35.15 42.67,35.15 43.69,35.15 44.7,35.15 45.72,35.15 46.74,35.15 47.75,35.15 48.77,35.15 49.78,35.15 41.66,36.17 42.67,36.17 43.69,36.17 44.7,36.17 45.72,36.17 46.74,36.17 47.75,36.17 48.77,36.17 49.78,36.17 41.66,37.19 42.67,37.19 43.69,37.19 44.7,37.19 45.72,37.19 46.74,37.19 47.75,37.19 48.77,37.19 49.78,37.19 41.66,38.2 42.67,38.2 43.69,38.2 44.7,38.2 45.72,38.2 46.74,38.2 47.75,38.2 48.77,38.2 49.78,38.2 42.67,39.22 43.69,39.22 44.7,39.22 45.72,39.22 46.74,39.22 47.75,39.22 48.77,39.22 49.78,39.22 50.8,39.22 51.82,39.22 52.83,39.22 52.83,35.15 43.69,40.23 44.7,40.23 48.77,40.23 49.78,40.23 43.69,41.25 43.69,42.27 44.7,42.27 48.77,42.27 49.78,41.25 49.78,42.27 42.67,43.28 43.69,43.28 44.7,43.28 48.77,43.28 49.78,43.28 52.83,40.23
  pour Top (isolate 0.254, no thermals): 41.05,44.5 41.05,30.48 54.86,30.48 54.86,44.5
  pour Bottom (isolate 0.254, no thermals): 41.05,44.5 41.05,30.48 54.86,30.48 54.86,44.5
  pour Route2 (isolate 0.381, no thermals): 41.05,44.5 41.05,30.48 54.86,30.48 54.86,44.5
RANGE  (1 unrouted)
SCL  (1 unrouted)
SDA  (1 unrouted)
SENSE  (via drill 0.33, 2.54)
  Top 0.61: R12.P$2 v54.05,29.67
  Bottom 0.61: v40.64,41.45 40.64,30.28 41.25,29.67 v54.05,29.67
SET
  Top 0.254: U2.6 22.69,33.19 22.66,33.22
  Top 0.406: R25.P$2 3.05,24.79 3.72,25.46 3.86,25.46 | R20.P$2 3.86,25.46 | 3.86,25.46 3.86,30.48 6.57,33.19 C2.1 20.56,33.22 22.66,33.22
SPI1-CLK  (via drill 0.33)
  Top 0.406: U3.4 v14.02,14.63 | v11.38,34.75 11.38,36.17 13.21,38 13.21,41.5 JP1.3
  Bottom 0.406: v14.02,14.63 14.02,15.04 13.61,15.44 10.97,15.44 10.16,16.26 10.16,33.53 v11.38,34.75
SPI1-DIN  (via drill 0.33)
  Top 0.406: U3.5 14.67,14.26 v15.04,14.63 | v12.19,34.34 12.19,35.76 v13.21,36.78
  Bottom 0.406: v15.04,14.63 15.04,15.04 13.82,16.26 11.38,16.26 11.18,16.46 11.18,33.33 v12.19,34.34 | v13.21,36.78 13.21,41.4 JP1.5
SPI2-CLK  (via drill 0.33)
  Top 0.406: U4.11 41.25,15.44 v40.64,14.83
  Bottom 0.406: v40.64,14.83 40.23,14.83 40.03,14.63 37.19,14.63 36.37,13.82 34.54,13.82 31.9,16.46 28.85,16.46 28.04,17.27 19.3,17.27 18.29,16.26 18.29,12.8 16.66,11.18 9.75,11.18 8.13,9.55 3.86,9.55 2.84,10.57 2.84,14.22 5.89,17.27 5.89,29.87 2.03,33.73 2.03,36.98 3.05,38 3.05,41.5 JP1.11
SPI2-DIN  (via drill 0.33)
  Top 0.406: U4.9 38.71,15.95 38.2,15.44 v35.56,15.44
  Bottom 0.406: JP1.12 4.27,39.22 4.88,38.61 6.91,38.61 7.52,38 7.52,15.24 9.96,12.8 15.85,12.8 16.66,13.61 16.66,17.07 18.49,18.9 32.11,18.9 v35.56,15.44
SPI2-DOUT  (via drill 0.33)
  Top 0.406: U4.10 39.98,15.8 v39.62,15.44 | v6.71,34.14 6.71,34.54 7.31,35.15 7.31,39.68 JP1.10
  Bottom 0.406: v39.62,15.44 36.78,15.44 35.97,14.63 34.95,14.63 31.5,18.09 18.9,18.09 17.47,16.66 17.47,13.21 16.26,11.99 9.55,11.99 6.71,14.83 v6.71,34.14
V+  (via drill 0.25)
  Top 0.406: C7.P$1 15.65,25.72 IC2.8 | U1.2 30.36,17.9 C6.P$1 | 36.78,24.18 C10.P$2 | U1.1 28.74,19.8 26.62,17.68 R40.1
  Top 0.457: R18.P$2 36.98,25.81 36.58,25.4 36.58,24.24 C10.P$2
  Top 0.559: 37.19,24.18 36.78,24.18 | C7.P$1 16.52,26.48 v16.66,26.62 | R38.P$2 v58.93,31.29 | C10.P$2 36.51,23.31 v36.17,22.96 | 30.36,17.9 30.09,17.9 v29.46,17.27
  Top 0.584: IC3.8 37.31,24.31 37.19,24.18
  other vias: 22.76,14.63 23.57,14.63 24.38,14.63 25.2,14.63 26.01,14.63 26.82,14.63 27.64,14.63 27.23,14.02 28.04,14.02 26.42,14.02 25.6,14.02 24.79,14.02 23.98,14.02 23.16,14.02 24.38,13.41 25.2,13.41 26.01,13.41 26.82,13.41 27.64,13.41 28.04,12.8 27.23,12.8 26.42,12.8 25.6,12.8 24.79,12.8
  pour Top (no thermals): 22.35,19.51 22.35,15.85 28.45,15.85 28.45,19.51
  pour Top (isolate 0.254, no thermals): 22.35,19.51 22.35,14.22 25.2,11.38 25.2,9.55 25.81,8.94 25.81,7.32 26.01,7.11 26.11,7.01 26.11,6.5 26.72,6.5 26.72,7.42 27.23,7.42 27.23,8.94 28.45,10.16 28.45,19.51
  pour Route2 (isolate 0.381, rank 6): 22.15,12.4 28.65,12.4 28.65,15.65 39.42,15.65 39.42,6.1 60.55,6.1 60.55,9.75 67.06,9.75 67.06,44.5 0.2,44.5 0.2,15.65 22.15,15.65
V+_REG
  Top 0.406: U1.8 28.74,24.1 26.62,26.21 R40.2
  pour Top (isolate 0.254, no thermals): 28.45,24.38 28.45,29.67 20.12,29.67 20.12,24.38
V_BATT  (via drill 0.25, 2.54)  (2 unrouted)
  other vias: 10.77,2.64 9.55,5.69 10.36,5.69 11.18,5.69 11.99,5.69 12.8,5.69 13.61,5.69 9.55,4.88 10.36,4.88 11.18,4.88 11.99,4.88 12.8,4.88 13.61,4.88 12.8,4.06 13.61,4.06 13.61,3.25 13.61,2.44 13.61,1.63 13.61,0.81 14.43,0.81 15.24,0.81 16.05,0.81 16.87,0.81 17.68,0.81 18.49,0.81 19.3,0.81 19.3,1.63 19.3,2.44 18.49,2.44 18.49,1.63 17.68,1.63 16.87,1.63 16.05,1.63 15.24,1.63 14.43,1.63 14.43,2.44 15.24,2.44 16.05,2.44 16.87,2.44 17.68,2.44 12.8,1.63 12.8,0.81 8.74,1.63 8.74,0.81 9.55,0.81 11.99,0.81 37.39,4.67 38.2,4.67 39.01,4.67 39.42,5.28 39.83,4.67 40.64,4.67 41.45,4.67 40.23,5.28 41.05,5.28 39.42,4.06 40.23,4.06 41.05,4.06 41.45,3.45 40.64,3.45 39.83,3.45 39.01,3.45 38.2,3.45 37.39,3.45 38.61,4.06 37.8,4.06 38.61,2.84 39.42,2.84 40.23,2.84 41.05,2.84 38.61,5.28 61.57,3.05 61.57,3.86 61.57,4.67 61.57,5.49 61.57,6.3 61.57,7.11 61.57,7.92 61.57,8.74 62.18,8.33 62.18,7.52 62.18,6.71 62.18,5.89 62.18,5.08 62.18,4.27 62.18,3.45 62.79,3.05 62.79,3.86 62.79,4.67 62.79,5.49 62.79,6.3 62.79,7.11 62.79,7.92 62.79,8.74 63.4,8.33 63.4,7.52 63.4,6.71 63.4,5.89 63.4,5.08 63.4,4.27 63.4,3.45 40.64,2.24 41.45,2.24 41.86,2.84 41.86,4.06 41.86,5.28 42.67,5.28 43.48,5.28 44.3,5.28 42.27,4.67 43.08,4.67 43.89,4.67 42.67,4.06 43.48,4.06 44.3,4.06 43.89,3.45 43.08,3.45 42.27,3.45 44.3,2.84 43.48,2.84 42.67,2.84 42.27,2.24 43.08,2.24 43.89,2.24 44.7,2.24 44.7,3.45 44.7,4.67 45.92,5.28 46.74,5.28 47.55,5.28 48.36,5.28 49.17,5.28 51.61,5.28 46.33,4.67 47.14,4.67 47.96,4.67 48.77,4.67 51.21,4.67 49.17,4.06 49.17,2.84 51.21,2.24 51.21,3.45 45.92,4.06 46.74,4.06 47.55,4.06 48.36,4.06 46.33,3.45 47.14,3.45 47.96,3.45 48.77,3.45 45.92,2.84 46.74,2.84 47.55,2.84 48.36,2.84 46.33,2.24 47.14,2.24 47.96,2.24 48.77,2.24 52.43,5.28 53.24,5.28 54.05,5.28 55.68,5.28 56.49,5.28 57.3,5.28 58.12,5.28 58.93,5.28 59.74,5.28 60.55,5.28 52.02,4.67 52.83,4.67 53.64,4.67 54.46,4.67 56.08,4.67 56.9,4.67 57.71,4.67 58.52,4.67 59.33,4.67 60.15,4.67 51.61,4.06 52.43,4.06 53.24,4.06 54.05,4.06 55.68,4.06 56.49,4.06 57.3,4.06 58.12,4.06 58.93,4.06 59.74,4.06 60.55,4.06 52.02,3.45 52.83,3.45 53.64,3.45 54.46,3.45 56.08,3.45 56.9,3.45 57.71,3.45 58.52,3.45 59.33,3.45 60.15,3.45 51.61,2.84 52.43,2.84 53.24,2.84 54.05,2.84 55.68,2.84 56.49,2.84 57.3,2.84 58.12,2.84 58.93,2.84 59.74,2.84 60.55,2.84 52.02,2.24 52.83,2.24 53.64,2.24 54.46,2.24 56.08,2.24 56.9,2.24 57.71,2.24 58.52,2.24 59.33,2.24 60.15,2.24 60.96,2.24 60.96,3.45 60.96,4.67 61.77,2.24 62.59,2.24 63.4,2.24 62.18,9.14 62.18,9.96 62.79,9.55
  pour Top (no thermals): 22.86,4.78 21.03,4.78 20.02,3.76 14.22,3.76 14.22,6.1 20.93,6.1 22.15,4.88 22.86,4.88
  pour Top (isolate 0.381, no thermals): 20.12,6.1 8.33,6.1 8.33,0.41 20.12,0.41
  pour Top (isolate 0.254, no thermals): 61.16,9.96 61.16,2.64 63.8,2.64 64.01,2.64 64.01,10.77 61.98,10.77 61.98,9.96
  pour Top (isolate 0.254, no thermals): 37.19,5.49 41.86,5.49 41.86,2.64 36.37,2.64 36.37,4.67 37.19,4.67
  pour Route2: 8.33,6.1 17.68,6.1 20.12,3.66 36.98,3.66 36.98,5.49 61.16,5.49 61.16,9.14 64.01,9.14 64.01,0.2 8.33,0.2
  pour Top (isolate 0.254, no thermals): 39.83,5.49 64.01,5.49 64.01,1.63 39.83,1.63
VREF  (via drill 0.25)
  Top 0.406: 14.02,18.09 U3.11 | U3.13 12.72,18.21 12.7,18.19
  Top 0.559: U7.5 12.6,17.41 | 12.6,17.41 13.75,17.41 14.02,17.68 | 14.02,17.68 14.02,18.09 | 12.7,18.19 12.7,17.51 12.6,17.41 | 14.02,17.68 14.02,17.27 v14.43,16.87 | v43.28,18.9 43.48,18.9 43.79,18.59 U4.13
  Bottom 0.559: v14.43,16.87 14.43,17.48 17.68,20.73 41.45,20.73 v43.28,18.9
VSET
  Top 0.406: U3.14 12.07,22.47 11.61,22.94 IC2.3

### Text on the board
Measures: uSupply | Output Board | v0001 | GND | 5V | GND | V_BATT